# Altium project CRD25DA12N-FMC V1-1 (07-2023).PrjPcb (part 2 of 8)

## Sheet 03 - Controller.SchDoc: Controller - 25kW WolfPACK FM3 Six-Pack Inverter
size 431 x 279 mm; Date: 07/2023; DocumentNumber: CRD25DA12N-FMC; Revision: 1.1; SheetNumber: 3; SheetTotal: 8; SheetSize: B
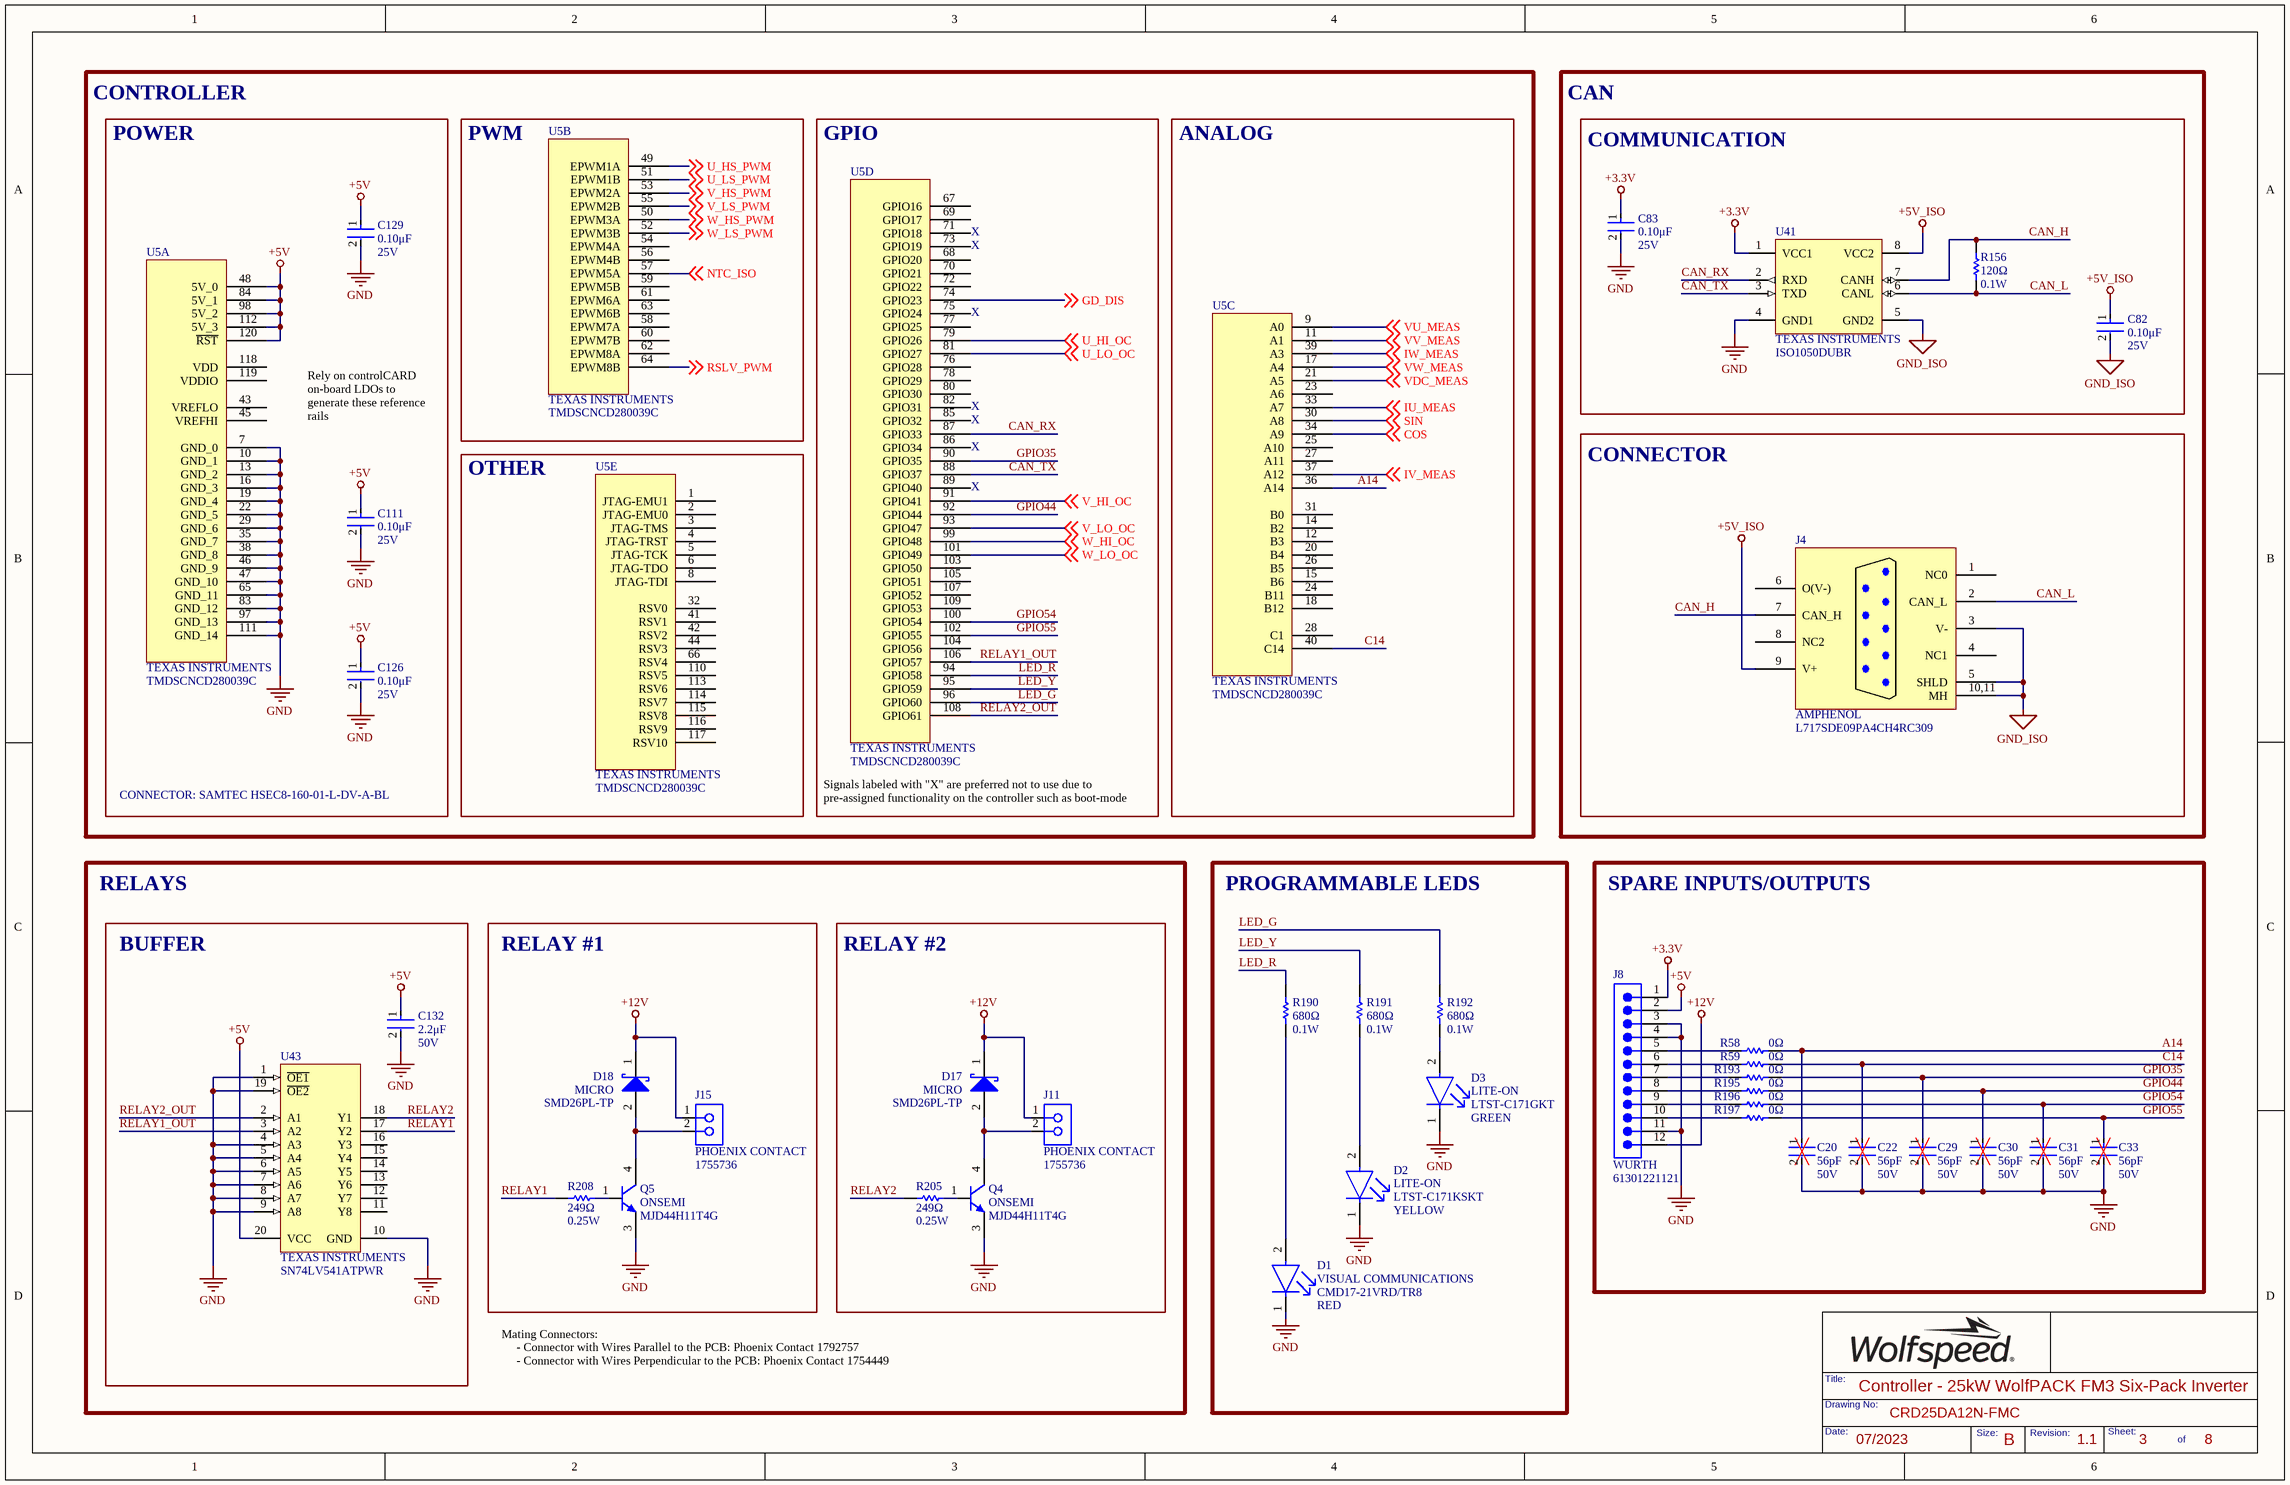
[diagram p2: 03 - Controller.SchDoc]

### Parts
C20  Capacitance: 56pF  Voltage Rating: 50V  [FP-C0603C-CF-IPC_B]  (hidden comment: CL10C560JB8NNNC)
C22  Capacitance: 56pF  Voltage Rating: 50V  [FP-C0603C-CF-IPC_B]  (hidden comment: CL10C560JB8NNNC)
C29  Capacitance: 56pF  Voltage Rating: 50V  [FP-C0603C-CF-IPC_B]  (hidden comment: CL10C560JB8NNNC)
C30  Capacitance: 56pF  Voltage Rating: 50V  [FP-C0603C-CF-IPC_B]  (hidden comment: CL10C560JB8NNNC)
C31  Capacitance: 56pF  Voltage Rating: 50V  [FP-C0603C-CF-IPC_B]  (hidden comment: CL10C560JB8NNNC)
C33  Capacitance: 56pF  Voltage Rating: 50V  [FP-C0603C-CF-IPC_B]  (hidden comment: CL10C560JB8NNNC)
C82  Voltage Rating: 25V  Capacitance: 0.10μF  [FP-C0603C-CF-IPC_B]  (hidden comment: C0603C104K3RACTU)
C83  Voltage Rating: 25V  Capacitance: 0.10μF  [FP-C0603C-CF-IPC_B]  (hidden comment: C0603C104K3RACTU)
C111  Voltage Rating: 25V  Capacitance: 0.10μF  [FP-C0603C-CF-IPC_B]  (hidden comment: C0603C104K3RACTU)
C126  Voltage Rating: 25V  Capacitance: 0.10μF  [FP-C0603C-CF-IPC_B]  (hidden comment: C0603C104K3RACTU)
C129  Voltage Rating: 25V  Capacitance: 0.10μF  [FP-C0603C-CF-IPC_B]  (hidden comment: C0603C104K3RACTU)
C132  Voltage Rating: 50V  Capacitance: 2.2μF  [FP-C0603C-CF-IPC_B]  (hidden comment: GRT188R61H225ME13D)
D1  value RED  Manufacturer: VISUAL COMMUNICATIONS  [FP-LTST-C171GKT-MFG-RED]  (hidden comment: CMD17-21VRD/TR8)
D2  LTST-C171KSKT  value YELLOW  Manufacturer: LITE-ON  [FP-LTST-C171GKT-MFG-YELLOW]
D3  value GREEN  Manufacturer: LITE-ON  [FP-LTST-C171GKT-MFG]  (hidden comment: LTST-C171GKT)
D17  SMD26PL-TP  Manufacturer Print: MICRO  [ONSC-SOD-123FL-2-498-01_V]
D18  SMD26PL-TP  Manufacturer Print: MICRO  [ONSC-SOD-123FL-2-498-01_V]
J4  Manufacturer: AMPHENOL  [L717SDE09PA4CH4RC309]  (hidden comment: L717SDE09PA4CH4RC309)
J8  Manufacturer Print: WURTH  [FP-61301221121-MFG]  (hidden comment: 61301221121)
J11  Manufacturer: PHOENIX CONTACT  [1755736]  (hidden comment: 1755736)
J15  Manufacturer: PHOENIX CONTACT  [1755736]  (hidden comment: 1755736)
Q4  Manufacturer: ONSEMI  [ONSC-DPAK-3-369C-01_V]  (hidden comment: MJD44H11T4G)
Q5  Manufacturer: ONSEMI  [ONSC-DPAK-3-369C-01_V]  (hidden comment: MJD44H11T4G)
R58  Resistance: 0Ω  [FP-MCR03-IPC_B]  (hidden comment: CRCW06030000Z0EB)
R59  Resistance: 0Ω  [FP-MCR03-IPC_B]  (hidden comment: CRCW06030000Z0EB)
R156  Resistance: 120Ω  Max Power Dissipation: 0.1W  [FP-MCR03-IPC_B]  (hidden comment: RC0603JR-07120RL)
R190  Power Rating: 0.1W  Resistance: 680Ω  [FP-MCR03-IPC_B]  (hidden comment: RC0603FR-07680RL)
R191  Power Rating: 0.1W  Resistance: 680Ω  [FP-MCR03-IPC_B]  (hidden comment: RC0603FR-07680RL)
R192  Power Rating: 0.1W  Resistance: 680Ω  [FP-MCR03-IPC_B]  (hidden comment: RC0603FR-07680RL)
R193  Resistance: 0Ω  [FP-MCR03-IPC_B]  (hidden comment: CRCW06030000Z0EB)
R195  Resistance: 0Ω  [FP-MCR03-IPC_B]  (hidden comment: CRCW06030000Z0EB)
R196  Resistance: 0Ω  [FP-MCR03-IPC_B]  (hidden comment: CRCW06030000Z0EB)
R197  Resistance: 0Ω  [FP-MCR03-IPC_B]  (hidden comment: CRCW06030000Z0EB)
R205  Resistance: 249Ω  Power Rating: 0.25W  [FP-MCR18-IPC_A]  (hidden comment: RC1206FR-07249RL)
R208  Resistance: 249Ω  Power Rating: 0.25W  [FP-MCR18-IPC_A]  (hidden comment: RC1206FR-07249RL)
U5  TMDSCNCD280039C  Manufacturer: TEXAS INSTRUMENTS  [TMDSCNCD280039C]  (parts A,B,C,D,E of 5)
U41  ISO1050DUBR  Manufacturer Print: TEXAS INSTRUMENTS  [DUB0008A_M]
U43  Manufacturer: TEXAS INSTRUMENTS  [PW0020A_L]  (hidden comment: SN74LV541ATPWR)

### Blocks framed on the sheet
POWER: C111 C126 C129 U5
PWM: U5
GPIO: U5
ANALOG: U5
COMMUNICATION: C82 C83 R156 U41
CONNECTOR: J4
OTHER: U5
PROGRAMMABLE LEDS: D1-D3 R190-R192
SPARE INPUTS/OUTPUTS: C20 C22 C29-C31 C33 J8 R58 R59 R193 R195-R197
BUFFER: C132 U43
RELAY #1: D18 J15 Q5 R208
RELAY #2: D17 J11 Q4 R205

### Nets
+3.3V: C83.1 J8.1 U41.1(VCC1)
+5V: C111.1 C126.1 C129.1 C132.1 J8.2 U5.48(5V_0) U5.84(5V_1) U5.98(5V_2) U5.112(5V_3) U5.120(~{RST}) U43.20(VCC)
+5V_ISO: C82.1 J4.9(V+) U41.8(VCC2)
+12V: D17.1(K) D18.1(K) J8.12 J11.1 J15.1
GND: C20.2 C22.2 C29.2 C30.2 C31.2 C33.2 C83.2 C111.2 C126.2 C129.2 C132.2 D1.1(C) D2.1(C) D3.1(C) J8.3 J8.4 J8.11 Q4.3(E) Q5.3(E) U5.7(GND_0) U5.10(GND_1) U5.13(GND_2) U5.16(GND_3) U5.19(GND_4) U5.22(GND_5) U5.29(GND_6) U5.35(GND_7) U5.38(GND_8) U5.46(GND_9) U5.47(GND_10) U5.65(GND_11) U5.83(GND_12) U5.97(GND_13) U5.111(GND_14) U41.4(GND1) U43.1(~{OE1}) U43.4(A3) U43.5(A4) U43.6(A5) U43.7(A6) U43.8(A7) U43.9(A8) U43.10(GND) U43.19(~{OE2})
GND_ISO: C82.2 J4.3(V-) J4.5(SHLD) J4.10,11(MH) U41.5(GND2)
A14: C20.1 R58.2 U5.36(A14)
C14: C22.1 R59.2 U5.40(C14)
CAN_H: J4.7(CAN_H) R156.2 U41.7(CANH)
CAN_L: J4.2(CAN_L) R156.1 U41.6(CANL)
CAN_RX: U5.87(GPIO33) U41.2(RXD)
CAN_TX: U5.88(GPIO37) U41.3(TXD)
COS: U5.34(A9) ; off-sheet COS
GD_DIS: U5.74(GPIO23) ; off-sheet GD_DIS
GPIO35: C29.1 R193.2 U5.90(GPIO35)
GPIO44: C30.1 R195.2 U5.92(GPIO44)
GPIO54: C31.1 R196.2 U5.100(GPIO54)
GPIO55: C33.1 R197.2 U5.102(GPIO55)
IU_MEAS: U5.33(A7) ; off-sheet IU_MEAS
IV_MEAS: U5.37(A12) ; off-sheet IV_MEAS
IW_MEAS: U5.39(A3) ; off-sheet IW_MEAS
LED_G: R192.2 U5.96(GPIO60)
LED_R: R190.2 U5.94(GPIO58)
LED_Y: R191.2 U5.95(GPIO59)
NTC_ISO: U5.57(EPWM5A) ; off-sheet NTC_ISO
RELAY1: R208.1 U43.17(Y2)
RELAY1_OUT: U5.106(GPIO57) U43.3(A2)
RELAY2: R205.1 U43.18(Y1)
RELAY2_OUT: U5.108(GPIO61) U43.2(A1)
RSLV_PWM: U5.64(EPWM8B) ; off-sheet RSLV_PWM
SIN: U5.30(A8) ; off-sheet SIN
U_HI_OC: U5.79(GPIO26) ; off-sheet U_HI_OC
U_HS_PWM: U5.49(EPWM1A) ; off-sheet U_HS_PWM
U_LO_OC: U5.81(GPIO27) ; off-sheet U_LO_OC
U_LS_PWM: U5.51(EPWM1B) ; off-sheet U_LS_PWM
V_HI_OC: U5.91(GPIO41) ; off-sheet V_HI_OC
V_HS_PWM: U5.53(EPWM2A) ; off-sheet V_HS_PWM
V_LO_OC: U5.93(GPIO47) ; off-sheet V_LO_OC
V_LS_PWM: U5.55(EPWM2B) ; off-sheet V_LS_PWM
VDC_MEAS: U5.21(A5) ; off-sheet VDC_MEAS
VU_MEAS: U5.9(A0) ; off-sheet VU_MEAS
VV_MEAS: U5.11(A1) ; off-sheet VV_MEAS
VW_MEAS: U5.17(A4) ; off-sheet VW_MEAS
W_HI_OC: U5.99(GPIO48) ; off-sheet W_HI_OC
W_HS_PWM: U5.50(EPWM3A) ; off-sheet W_HS_PWM
W_LO_OC: U5.101(GPIO49) ; off-sheet W_LO_OC
W_LS_PWM: U5.52(EPWM3B) ; off-sheet W_LS_PWM
NetD1_2: D1.2(A) R190.1
NetD2_2: D2.2(A) R191.1
NetD3_2: D3.2(A) R192.1
NetD17_2: D17.2(A) J11.2 Q4.4(C)
NetD18_2: D18.2(A) J15.2 Q5.4(C)
NetJ8_5: J8.5 R58.1
NetJ8_6: J8.6 R59.1
NetJ8_7: J8.7 R193.1
NetJ8_8: J8.8 R195.1
NetJ8_9: J8.9 R196.1
NetJ8_10: J8.10 R197.1
NetQ4_1: Q4.1(B) R205.2
NetQ5_1: Q5.1(B) R208.2

Not connected (* = marked no-connect by the designer): J4 1(NC0) 4(NC1) 6(O(V-)) 8(NC2); U5 1(JTAG-EMU1) 2(JTAG-EMU0) 3(JTAG-TMS) 4(JTAG-TRST) 5(JTAG-TCK) 6(JTAG-TDO) 8(JTAG-TDI) 12(B3) 14(B2) 15(B6) 18(B12) 20(B4) 23(A6) 24(B11) 25(A10) 26(B5) 27(A11) 28(C1) 31(B0) 32(RSV0) 41(RSV1) 42(RSV2) 43(VREFLO) 44(RSV3) 45(VREFHI) 54(EPWM4A) 56(EPWM4B) 58(EPWM7A) 59(EPWM5B) 60(EPWM7B) 61(EPWM6A) 62(EPWM8A) 63(EPWM6B) 66(RSV4) 67(GPIO16) 68(GPIO20) 69(GPIO17) 70(GPIO21) 71(GPIO18) 72(GPIO22) 73(GPIO19) 75(GPIO24) 76(GPIO28) 77(GPIO25) 78(GPIO29) 80(GPIO30) 82(GPIO31) 85(GPIO32) 86(GPIO34) 89(GPIO40) 103(GPIO50) 104(GPIO56) 105(GPIO51) 107(GPIO52) 109(GPIO53) 110(RSV5) 113(RSV6) 114(RSV7) 115(RSV8) 116(RSV9) 117(RSV10) 118(VDD) 119(VDDIO); U43 11(Y8) 12(Y7) 13(Y6) 14(Y5) 15(Y4) 16(Y3)

### Notes on the sheet
- CONTROLLER
- CAN
- (near U5) X
- Rely on controlCARD on-board LDOs to generate these reference rails
- CONNECTOR: SAMTEC HSEC8-160-01-L-DV-A-BL
- Signals labeled with "X" are preferred not to use due to pre-assigned functionality on the controller such as boot-mode selection or on-board LEDs
- RELAYS
- Mating Connectors:
  - Connector with Wires Parallel to the PCB: Phoenix Contact 1792757
  - Connector with Wires Perpendicular to the PCB: Phoenix Contact 1754449
- Title:
- Date:
- Drawing No:
- Size:
- Revision:
- Sheet:
- of

### Library data of the parts
C20 C22 C29-C31 C33 = CL10C560JB8NNNC: CAP CER 56PF 50V C0G/NP0 0603; Manufacturer: SAMSUNG; Material: Ceramic; Tolerance: 5%; Dielectric: C0G; Temperature Coefficient: 30ppm/°C; Supplier 1: Arrow Electronics; Manufacturer Part Number: CL10C560JB8NNNC; RoHS: Yes; Category: Ceramic Capacitors; Stock 1: 60182; Pricing 1: 1=0.05960, 10=0.01370, 25=0.01360, 100=0.01080, 250=0.01070, 500=0.00740, 1000=0.00590, 3000=0.00560, 6000=0.00530, 15000=0.00500, 30000=0.00470 (USD); Mount: Surface Mount; Case Code (Metric): 1608; Case Code (Imperial): 0603; Min Operating Temperature: -55°C; Max Operating Temperature: 125°C; Packaging: Tape and Reel; Package Quantity: 1; Voltage: 50V; Voltage Rating (DC): 50V; Series: CL; Construction: Flat; Termination: SMD/SMT; Length: 1.6mm; Width: 0.031inch; Height: 0.8mm; Thickness: 0.035inch; Depth: 0.8mm; Radiation Hardening: No; Lead Free: Lead Free; RoHS Compliant: Yes; ComponentLink1URL: https://datasheet.ciiva.com/25803/cl10c560jb8nnnc-25803592.pdf?src-supplier=Digi-Key; ComponentLink1Description: https://datasheet.ciiva.com/25803/cl10c560jb8nnnc-25803592.pdf?src-supplier=Digi-Key; ComponentLink2URL: https://datasheet.ciiva.com/26838/getdatasheetpartid-640760-26838546.pdf?src-supplier=Verical; ComponentLink2Description: https://datasheet.ciiva.com/26838/getdatasheetpartid-640760-26838546.pdf?src-supplier=Verical; ComponentLink3URL: https://datasheet.ciiva.com/29198/456837-da-01-en-vs-kondensator-0603-29198873.pdf?src-supplier=Conrad; ComponentLink3Description: https://datasheet.ciiva.com/29198/456837-da-01-en-vs-kondensator-0603-29198873.pdf?src-supplier=Conrad; ComponentLink4URL: https://datasheet.ciiva.com/48428/mlcc-catalogdownload2013-eng-48428598.pdf?src-supplier=Distrelec; ComponentLink4Description: https://datasheet.ciiva.com/48428/mlcc-catalogdownload2013-eng-48428598.pdf?src-supplier=Distrelec; ComponentLink5URL: https://datasheet.ciiva.com/16449/cl05b104kq5nnnc-16449527.pdf?src-supplier=Future+Electronics; ComponentLink5Description: https://datasheet.ciiva.com/16449/cl05b104kq5nnnc-16449527.pdf?src-supplier=Future+Electronics; Supplier Part Number 1: CL10C560JB8NNNC; Package: 0603; Value: 56pF
C82 C83 C111 C126 C129 = CMP-2006-03057-2: CAP CER 0.1UF 25V X7R 0603; Manufacturer: KEMET; Value: 0.10μF; Material: Ceramic; Tolerance: 0.1; Temperature Coefficient: 30ppm/°C; Automotive Grade: Grade 1; Lead Free: Yes; Device Class L3: Ceramic Capacitors; Manufacturer Part Number: C0603C104K3RACTU; Digikey Description: CAP CER 0.1UF 25V X7R 0603; Mouser Description: Multilayer Ceramic Capacitors MLCC - SMD/SMT 25volts 0.1uF X7R 10%; Package: 0603; Temperature Range Low: -55°C; Automotive: Yes; Device Class L2: Capacitors; Octopart: https://octopart.com/c0603c104k3ractu-kemet-127541; ComponentLink2Description: Datasheet; ComponentLink2URL: https://api.kemet.com/component-edge/download/datasheet/C0603C100J5GACAUTO.pdf; Temperature Range High: +125°C; RoHS: TRUE; Device Class L1: Passive Components; Category: Cap; Temperature: -55°C to +125°C; Height: 0.87mm; Temperature Characteristic: X7R
C132 = GRT188R61H225ME13D: CAP CER 2.2UF 50V X5R 0603; Manufacturer: MURATA; Tolerance: 20%; Value: 2.2μF; Supplier 1: Arrow Electronics; Manufacturer Part Number: GRT188R61H225ME13D; RoHS: Yes; Category: Ceramic Capacitors; Stock 1: 3937; Pricing 1: 1=0.29580, 10=0.20370, 25=0.18090, 100=0.12380, 250=0.12190, 500=0.10920, 1000=0.07700, 3000=0.07630 (USD); Mount: Surface Mount; Case Code (Metric): 1608; Case Code (Imperial): 0603; Min Operating Temperature: -55°C; Max Operating Temperature: 85°C; Packaging: Tape and Reel; Length: 0.063inch; Width: 0.031inch; Thickness: 0.035inch; Ratings: AEC-Q200; RoHS Compliant: Yes; ComponentLink1URL: http://search.murata.co.jp/Ceramy/image/img/A01X/G101/ENG/GRT188R61H225ME13-01.pdf?src-supplier=Digi-Key; ComponentLink1Description: http://search.murata.co.jp/Ceramy/image/img/A01X/G101/ENG/GRT188R61H225ME13-01.pdf?src-supplier=Digi-Key; ComponentLink2URL: https://search.murata.co.jp/Ceramy/image/img/A01X/G101/ENG/GRT188R61H225ME13-01.pdf?src-supplier=Digi-Key; ComponentLink2Description: https://search.murata.co.jp/Ceramy/image/img/A01X/G101/ENG/GRT188R61H225ME13-01.pdf?src-supplier=Digi-Key; Supplier Part Number 1: GRT188R61H225ME13D; Package: 0603
D1 = CMD17-21VRD/TR8: LED RED DIFFUSED 0805 SMD; Power Rating: 100mW; Luminous Intensity: 6mcd; Viewing Angle: 140°; Lens Style: Diffused,Tinted,Rectangular,Colored; Forward Current: 20mA; Forward Voltage: 2V; Wavelength: 640nm; Reverse Voltage (DC): 5V; Number of LEDs: 1; Supplier 1: Newark; RoHS: Yes; Category: LEDs; Stock 1: 1791; Pricing 1: 1=0.55000, 25=0.37500, 50=0.31600, 100=0.25700, 250=0.25600, 500=0.25400, 1000=0.21500 (USD); Mount: Surface Mount; Package: 0805; Number of Pins: 2; Color: RED; Case Code (Metric): 2012; Case Code (Imperial): 0805; Lens Color: Red; Min Operating Temperature: -40°C; Max Operating Temperature: 85°C; Packaging: Tape and Reel; Package Quantity: 1; Illumination Color: Red; Test Current: 20mA; Reverse Voltage: 5V; Length: 2mm; Width: 1.25mm; Height: 1.1mm; RoHS Compliant: Yes; Lead Free: Lead Free; ComponentLink1URL: http://www.mouser.com/ds/2/423/CMD1721ver1-1064576.pdf?src-supplier=Mouser; ComponentLink1Description: http://www.mouser.com/ds/2/423/CMD1721ver1-1064576.pdf?src-supplier=Mouser; ComponentLink2URL: https://www.alliedelec.com/m/d/ea8f758becbd32522d2612194452bcae.pdf?src-supplier=Allied+Electronics; ComponentLink2Description: https://www.alliedelec.com/m/d/ea8f758becbd32522d2612194452bcae.pdf?src-supplier=Allied+Electronics; ComponentLink3URL: http://www.onlinecomponents.com/productFiles/mf-CM/2cmd17-21seriessmtleds0805packagesize.pdf?src-supplier=Onlinecomponents.com; ComponentLink3Description: http://www.onlinecomponents.com/productFiles/mf-CM/2cmd17-21seriessmtleds0805packagesize.pdf?src-supplier=Onlinecomponents.com; ComponentLink4URL: https://vcclite.com/wp-content/uploads/wpallimport/files/files/CMD1721Seriesver3.pdf?src-supplier=Digi-Key; ComponentLink4Description: https://vcclite.com/wp-content/uploads/wpallimport/files/files/CMD1721Seriesver3.pdf?src-supplier=Digi-Key; Supplier Part Number 1: 45X6246; Manufacturer Part Number: CMD17-21VRD/TR8
D2 = LTST-C171KSKT: LED YELLOW CLEAR 0805 SMD; Lens Color: Colorless; Number of LEDs: 1; Reverse Voltage: 5V; Viewing Angle: 130°; Lens Style: Diffused,Colorless,Rectangular,Clear; Luminous Intensity: 50mcd; Forward Voltage: 2V; Dominant Wavelength: 587nm; Test Current: 20mA; Wavelength: 588nm; Forward Current: 30mA; Max Power Dissipation: 75mW; Supplier 1: Rs; Manufacturer Part Number: LTST-C171KSKT; RoHS: Yes; Category: LEDs; Stock 1: 850; Mount: Surface Mount; Package: 0805; Number of Pins: 2; Color: Yellow; Case Code (Metric): 2012; Case Code (Imperial): 0805; Min Operating Temperature: -55°C; Max Operating Temperature: 85°C; Package Quantity: 1; Packaging: Tape and Reel; Lens Transparency: Clear; Series: CHIPLED 0805; Illumination Color: Yellow; Power Rating: 75mW; Number of Elements: 1; Power Dissipation: 75mW; Length: 2mm; Width: 1.25mm; Height: 0.8mm; Depth: 1.25mm; Radiation Hardening: No; Lead Free: Lead Free; RoHS Compliant: Yes; ComponentLink1URL: https://datasheet.ciiva.com/19466/2075639-19466196.pdf?src-supplier=Jameco; ComponentLink1Description: https://datasheet.ciiva.com/19466/2075639-19466196.pdf?src-supplier=Jameco; ComponentLink2URL: https://datasheet.ciiva.com/12403/lite-on-ltst-c171kskt-190118-12403721.pdf?src-supplier=Mouser; ComponentLink2Description: https://datasheet.ciiva.com/12403/lite-on-ltst-c171kskt-190118-12403721.pdf?src-supplier=Mouser; ComponentLink3URL: https://datasheet.ciiva.com/16200/lite-on20ltst-c171kskt-16200102.pdf?src-supplier=Future+Electronics; ComponentLink3Description: https://datasheet.ciiva.com/16200/lite-on20ltst-c171kskt-16200102.pdf?src-supplier=Future+Electronics; ComponentLink4URL: https://datasheet.ciiva.com/15118/getdatasheetpartid-233685-15118145.pdf?src-supplier=Verical; ComponentLink4Description: https://datasheet.ciiva.com/15118/getdatasheetpartid-233685-15118145.pdf?src-supplier=Verical; ComponentLink5URL: https://datasheet.ciiva.com/11774/0900766b80dc029a-11774587.pdf?src-supplier=Rs; ComponentLink5Description: https://datasheet.ciiva.com/11774/0900766b80dc029a-11774587.pdf?src-supplier=Rs; ComponentLink6URL: https://datasheet.ciiva.com/2110/s-110-ltst-c171kskt-2110148.pdf?src-supplier=Digi-Key; ComponentLink6Description: https://datasheet.ciiva.com/2110/s-110-ltst-c171kskt-2110148.pdf?src-supplier=Digi-Key; ComponentLink7URL: https://datasheet.ciiva.com/2110/s-110-ltst-c171kskt-2110147.pdf?src-supplier=Digi-Key; ComponentLink7Description: https://datasheet.ciiva.com/2110/s-110-ltst-c171kskt-2110147.pdf?src-supplier=Digi-Key; ComponentLink8URL: https://datasheet.ciiva.com/2110/s-110-ltst-c171kskt-2110149.pdf?src-supplier=Digi-Key; ComponentLink8Description: https://datasheet.ciiva.com/2110/s-110-ltst-c171kskt-2110149.pdf?src-supplier=Digi-Key; Supplier Part Number 1: 6920950
D3 = CMP-22017-000007-1: LED GREEN CLEAR CHIP SMD; Luminous Intensity: 12mcd; Lens Color: Colorless; Dominant Wavelength: 569nm; Number of LEDs: 1; Power Dissipation: 100mW; Viewing Angle: 130°; Reverse Voltage: 5V; Test Current: 10mA; Forward Voltage: 2.1V; Wavelength: 585nm; Lens Style: Diffused; Forward Current: 30mA; Height: 0.8mm; Mount: Surface Mount; Package Quantity: 1; Length: 2mm; Case Code (Metric): 2012; Number of Pins: 2; Number of Elements: 1; Packaging: Tape and Reel; Color: GREEN; Min Operating Temperature: -55°C; Case/Package: 0805; Power Rating: 100mW; Max Operating Temperature: 85°C; Radiation Hardening: No; Depth: 1.25mm; Lens Transparency: Clear; Width: 1.25mm; Lead Free: Lead Free; Case Code (Imperial): 0805; Illumination Color: Green; Manufacturer Part Number: LTST-C171GKT; Package: 0805
D17 D18 = SMD26PL-TP: DIODE SCHOTTKY 60V 2A SOD123FL; Manufacturer: MICRO COMMERCIAL; Forward Voltage: 700mV; Max Reverse Current: 500uA; Max Surge Current: 50A; Max Power Dissipation: 1.68W; Supplier 1: Digi-Key; Manufacturer Part Number: SMD26PL-TP; RoHS: Yes; Category: Rectifier Diodes; Stock 1: 317348; Pricing 1: 1=0.40000, 10=0.30200, 100=0.18790, 500=0.12854, 1000=0.09888 (USD); Mount: Surface Mount; Number of Pins: 2; Min Operating Temperature: -65°C; Max Operating Temperature: 125°C; Packaging: Tape and Reel; Package Quantity: 1; Average Rectified Current: 2A; Max Repetitive Reverse Voltage (Vrrm): 60V; Max Reverse Voltage (DC): 60V; Lead Free: Lead Free; RoHS Compliant: Yes; ComponentLink1URL: https://datasheet.ciiva.com/4717/smd22pl-smd210plsod-123fl-27814-4717414.pdf?src-supplier=Mouser; ComponentLink1Description: https://datasheet.ciiva.com/4717/smd22pl-smd210plsod-123fl-27814-4717414.pdf?src-supplier=Mouser; ComponentLink2URL: https://datasheet.ciiva.com/17444/smd22pl-smd210plsod-123fl-17444944.pdf?src-supplier=Future+Electronics; ComponentLink2Description: https://datasheet.ciiva.com/17444/smd22pl-smd210plsod-123fl-17444944.pdf?src-supplier=Future+Electronics; ComponentLink3URL: https://datasheet.ciiva.com/917/smd22pl-smd210plsod-123fl-917242.pdf?src-supplier=Digi-Key; ComponentLink3Description: https://datasheet.ciiva.com/917/smd22pl-smd210plsod-123fl-917242.pdf?src-supplier=Digi-Key; ComponentLink4URL: https://datasheet.ciiva.com/917/smd22pl-smd210plsod-123fl-917243.pdf?src-supplier=Digi-Key; ComponentLink4Description: https://datasheet.ciiva.com/917/smd22pl-smd210plsod-123fl-917243.pdf?src-supplier=Digi-Key; ComponentLink5URL: https://datasheet.ciiva.com/917/smd22pl-smd210plsod-123fl-917244.pdf?src-supplier=Digi-Key; ComponentLink5Description: https://datasheet.ciiva.com/917/smd22pl-smd210plsod-123fl-917244.pdf?src-supplier=Digi-Key; Supplier Part Number 1: SMD26PL-TPMSCT-ND; Value: N/A; Package: SOD-123F
J4 = L717SDE09PA4CH4RC309: CONN D-SUB PLUG 9POS R/A SLDR; Number of Terminals/Pins: 9; Connector Type: D-Sub,Plug; Voltage Rating: 250V; Current Rating: 5A; Number of Ports: 1; Pitch: 2.74mm; Value: N/A; Package: N/A; Supplier 1: Allied Electronics; RoHS: Yes; Category: Uncategorized; Mount: Through Hole; Contact Plating: Gold; Contact Material: Brass; Color: Black; Housing Material: Thermoplastic; Min Operating Temperature: -55°C; Max Operating Temperature: 155°C; Number of Rows: 2; Packaging: Tray; Number of Positions: 9; Termination: Solder; Max Supply Voltage (AC): 250V; Number of Contacts: 9; Orientation: Right Angle; Series: SD; Contact Type: Signal; Length: 30.81mm; Depth: 20.3mm; Lead Free: Lead Free; RoHS Compliant: Yes; ComponentLink1URL: https://datasheet.ciiva.com/16443/l717sde09pa4ch4rc309-16443356.pdf?src-supplier=Future+Electronics; ComponentLink1Description: https://datasheet.ciiva.com/16443/l717sde09pa4ch4rc309-16443356.pdf?src-supplier=Future+Electronics; ComponentLink2URL: https://datasheet.ciiva.com/12662/l717sde09pa4ch4rc309-12662371.pdf?src-supplier=Mouser; ComponentLink2Description: https://datasheet.ciiva.com/12662/l717sde09pa4ch4rc309-12662371.pdf?src-supplier=Mouser; ComponentLink3URL: https://datasheet.ciiva.com/16914/70145027-16914009.pdf?src-supplier=Allied+Electronics; ComponentLink3Description: https://datasheet.ciiva.com/16914/70145027-16914009.pdf?src-supplier=Allied+Electronics; ComponentLink4URL: https://datasheet.ciiva.com/16748/sd-hdh808-16748518.pdf?; ComponentLink4Description: https://datasheet.ciiva.com/16748/sd-hdh808-16748518.pdf?; Supplier Part Number 1: 70145033; Manufacturer Part Number: L717SDE09PA4CH4RC309
J8 = 61301221121: CONN HEADER VERT 12POS 2.54MM; Manufacturer: WURTH ELEKTRONIK; Number of Positions: 12; Gender: Male; Voltage Rating: 250V; Pitch: 0.1inch; Supplier 1: Digi-Key; RoHS: Yes; Category: Headers and Wire Housings; Stock 1: 5429; Pricing 1: 1=0.83000, 10=0.70700, 25=0.58920, 50=0.49100, 100=0.44700, 1000=0.40600 (USD); Mount: Through Hole; Contact Plating: Gold; Contact Material: Copper Alloy,Copper; Color: Black; Contact Shape: Square; Contact Finish - Mating: GOLD; Insulation Material: Nylon; Insulation Color: Black; Min Operating Temperature: -40°C; Max Operating Temperature: 105°C; Number of Rows: 2; Packaging: Bulk; Termination: Solder; Number of Contacts: 12; Connector Type: Header; Fastening Type: Pull; Series: WR-PHD; Contact Type: Male Pin; Row Spacing: 0.1inch; Contact Mating Length: 0.236inch; RoHS Compliant: Yes; Flammability Rating: UL94 V-0; ComponentLink1URL: http://www.farnell.com/datasheets/1442180.pdf?src-supplier=Farnell; ComponentLink1Description: http://www.farnell.com/datasheets/1442180.pdf?src-supplier=Farnell; ComponentLink2URL: http://www.farnell.com/datasheets/1442180.pdf?src-supplier=Newark; ComponentLink2Description: http://www.farnell.com/datasheets/1442180.pdf?src-supplier=Newark; ComponentLink3URL: http://www.farnell.com/datasheets/1442180.pdf?src-supplier=Element14; ComponentLink3Description: http://www.farnell.com/datasheets/1442180.pdf?src-supplier=Element14; ComponentLink4URL: https://katalog.we-online.de/em/datasheet/6130xx21121.pdf?src-supplier=Digi-Key; ComponentLink4Description: https://katalog.we-online.de/em/datasheet/6130xx21121.pdf?src-supplier=Digi-Key; Supplier Part Number 1: 732-5297-ND; Package: N/A; Value: N/A; Manufacturer Part Number: 61301221121
J11 J15 = 1755736: TERM BLOCK HDR 2POS VERT 5.08MM; Content: 250pc(s); Industrial packaging: Yes; Number of contacts: 2; Manufacturer URL: http://www.phoenixcontact.com/; Datasheet Version: Apr-16; Pitch: 5.08mm; Datasheet URL: http://www.mouser.com/ds/2/324/ItemDetail_1755736-921028.pdf; Manufacturer Part Number: 1755736; Type: MSTBVA2,5/2-G-5,08; Colour: Green; Supplier 1: Rs; Supplier Part Number 1: 1896199; Value: N/A; Package: N/A
Q4 Q5 = CMP-1046-00010-1: TRANS NPN 80V 8A DPAK; IC Continuous (A): 8; Packing: Tape and Reel; PackageVersion: Rev. E, 02/2014; Polarity: NPN; ComponentLink2Description: Datasheet; ComponentLink2URL: http://www.onsemi.cn/pub_link/Collateral/MJD44H11-D.PDF; ComponentLink1URL: http://www.onsemi.com/; PackageReference: DPAK-3-369C-01; Mounting Technology: Surface Mount; ComponentLink1Description: Manufacturer URL; ComponentLink3URL: http://www.onsemi.cn/pub_link/Collateral/369C.PDF; ComponentLink3Description: Package Specification; PartNumber: MJD44H11T4G; PackageDescription: 3-Pin Flange Mount, Body 6.54 x 6.095 mm, Pitch 2.29 mm; DatasheetVersion: Rev. 16; RoHS: TRUE; Value: N/A; Manufacturer Part Number: MJD44H11T4G; Package: TO-252-3
R58 R59 R193 R195-R197 = CRCW06030000Z0EB: RES SMD 0 OHM JUMPER 1/10W 0603; Manufacturer: VISHAY DALE; Manufacturer Part Number: CRCW06030000Z0EBC; Max Power Dissipation: 100mW; Voltage Rating: 75V; Tolerance: 1%; Temperature Coefficient: 100ppm/°C; Value: 0Ω; Supplier 1: Newark; RoHS: Yes; Category: Chip SMD Resistors; Stock 1: 110000; Pricing 1: 1=0.00300, 10000=0.00300 (USD); Package: 0603; Number of Pins: 2; Case Code (Imperial): 0603; Case Code (Metric): 1608; Weight: 7.1E-05oz; Contact Plating: Tin; Size Code: 0603; Min Operating Temperature: -55°C; Max Operating Temperature: 155°C; Packaging: Tape and Reel; Resistor Type: Thick Film; Number of Terminations: 2; Features: Automotive AEC-Q200; Package Quantity: 10000; Termination: SMD/SMT; Voltage Rating (DC): 75V; Series: CRCW; Construction: Rectangular; Technology: THICK FILM; Length: 1.55mm; Width: 0.033inch; Height: 0.45mm; Depth: 0.85mm; Ratings: AEC-Q200; Radiation Hardening: No; RoHS Compliant: Yes; Lead Free: Lead Free; Military Standard: Not; ComponentLink1URL: https://datasheet.ciiva.com/11808/0900766b80d98afc-11808678.pdf?src-supplier=Rs; ComponentLink1Description: https://datasheet.ciiva.com/11808/0900766b80d98afc-11808678.pdf?src-supplier=Rs; ComponentLink2URL: https://datasheet.ciiva.com/2563/dcrcwe3-2563949.pdf?src-supplier=Digi-Key; ComponentLink2Description: https://datasheet.ciiva.com/2563/dcrcwe3-2563949.pdf?src-supplier=Digi-Key; ComponentLink3URL: https://datasheet.ciiva.com/5550/dcrcwe3-109170-5550748.pdf?src-supplier=Mouser; ComponentLink3Description: https://datasheet.ciiva.com/5550/dcrcwe3-109170-5550748.pdf?src-supplier=Mouser; ComponentLink4URL: https://datasheet.ciiva.com/16430/dcrcwe3-16430060.pdf?src-supplier=Future+Electronics; ComponentLink4Description: https://datasheet.ciiva.com/16430/dcrcwe3-16430060.pdf?src-supplier=Future+Electronics; ComponentLink5URL: https://datasheet.ciiva.com/7791/dcrcwe3-7791992.pdf?src-supplier=Element14; ComponentLink5Description: https://datasheet.ciiva.com/7791/dcrcwe3-7791992.pdf?src-supplier=Element14; Supplier Part Number 1: 48P7902
R156 = RC0603JR-07120RL: RES SMD 120 OHM 5% 1/10W 0603; Manufacturer: YAGEO; Voltage Rating (DC): 50V; Temperature Coefficient: 100ppm/°C; Power Rating: 100mW; Value: 120Ω; Tolerance: 5%; Lead Free: Lead Free; Package: 0603; Max Operating Temperature: 155°C; Length: 1.6mm; Construction: Rectangular; Case Code (Imperial): 0603; Number of Pins: 2; Termination: SMD/SMT; Width: 0.8mm; Height: 0.022inch; Military Standard: Not; Series: RC; Number of Terminations: 2; Package Quantity: 1; Resistance Tolerance: 5%; Voltage Rating: 50V; Case Code (Metric): 1608; Features: Moisture Resistant; REACH SVHC: No SVHC; Min Operating Temperature: -55°C; Size Code: 0603; Packaging: Tape and Reel; Depth: 0.8mm; Resistor Type: Thick Film; RoHS Compliant: Yes; Supplier 1: Rs; Supplier Part Number 1: 2424206; Manufacturer Part Number: RC0603JR-07120RL
R190-R192 = RC0603FR-07680RL: RES 680 OHM 1% 1/10W 0603; Manufacturer: YAGEO; Voltage Rating (DC): 50V; Temperature Coefficient: 100ppm/°C; Max Power Dissipation: 100mW; Value: 680Ω; Supplier 1: Future Electronics; Manufacturer Part Number: RC0603FR-07680RL; RoHS: Yes; Category: Chip SMD Resistors; Stock 1: 1640000; Pricing 1: 5000=0.00150, 50000=0.00140, 200000=0.00140, 625000=0.00130, 2000000=0.00120 (USD); Package: 0603; Number of Pins: 2; Case Code (Imperial): 0603; Case Code (Metric): 1608; Size Code: 0603; Min Operating Temperature: -55°C; Max Operating Temperature: 155°C; Packaging: Tape and Reel; Tolerance: 1%; Resistor Type: Thick Film; Voltage Rating: 50V; Package Quantity: 1; Termination: SMD/SMT; Number of Terminations: 2; Features: Moisture Resistant; Series: RC; Resistance Tolerance: 1%; Construction: Rectangular; Length: 1.6mm; Width: 0.8mm; Height: 0.022inch; Depth: 0.8mm; Reach SVHC Compliant: Yes; Lead Free: Lead Free; Military Standard: Not; RoHS Compliant: Yes; ComponentLink1URL: https://datasheet.ciiva.com/46412/443971-46412854.pdf?src-supplier=Element14; ComponentLink1Description: https://datasheet.ciiva.com/46412/443971-46412854.pdf?src-supplier=Element14; ComponentLink2URL: https://datasheet.ciiva.com/2553/pyu-r-int-thick-7-2553546.pdf?src-supplier=Digi-Key; ComponentLink2Description: https://datasheet.ciiva.com/2553/pyu-r-int-thick-7-2553546.pdf?src-supplier=Digi-Key; ComponentLink3URL: https://datasheet.ciiva.com/2553/pyu-r-int-thick-7-2553547.pdf?src-supplier=Digi-Key; ComponentLink3Description: https://datasheet.ciiva.com/2553/pyu-r-int-thick-7-2553547.pdf?src-supplier=Digi-Key; ComponentLink4URL: https://datasheet.ciiva.com/2553/pyu-r-int-thick-7-2553545.pdf?src-supplier=Digi-Key; ComponentLink4Description: https://datasheet.ciiva.com/2553/pyu-r-int-thick-7-2553545.pdf?src-supplier=Digi-Key; ComponentLink5URL: https://datasheet.ciiva.com/7746/443971-7746389.pdf?src-supplier=Element14; ComponentLink5Description: https://datasheet.ciiva.com/7746/443971-7746389.pdf?src-supplier=Element14; Supplier Part Number 1: 6789788
R205 R208 = RC1206FR-07249RL: RES 249 OHM 1% 1/4W 1206; Manufacturer: YAGEO; Voltage Rating: 200V; Temperature Coefficient: 100ppm/°C; Max Power Dissipation: 250mW; Value: 249Ω; Supplier 1: Future Electronics; Manufacturer Part Number: RC1206FR-07249RL; RoHS: Yes; Category: Chip SMD Resistors; Stock 1: 560000; Pricing 1: 5000=0.00430, 25000=0.00410, 100000=0.00390, 250000=0.00370, 625000=0.00350 (USD); Package: 1206; Case Code (Imperial): 1206; Case Code (Metric): 3216; Size Code: 1206; Min Operating Temperature: -55°C; Max Operating Temperature: 155°C; Tolerance: 1%; Packaging: Tape and Reel; Termination: SMD/SMT; Resistor Type: Thick Film; Voltage Rating (DC): 200V; Features: Moisture Resistant; Series: RC; Number of Terminations: 2; Construction: Rectangular; Length: 3.1mm; Depth: 1.6mm; Military Standard: Not; Lead Free: Lead Free; RoHS Compliant: Yes; ComponentLink1URL: https://datasheet.ciiva.com/16747/pyu-rc1206-51-rohs-l-4-16747103.pdf?src-supplier=Future+Electronics; ComponentLink1Description: https://datasheet.ciiva.com/16747/pyu-rc1206-51-rohs-l-4-16747103.pdf?src-supplier=Future+Electronics; Supplier Part Number 1: 1142064
U5 = TMDSCNCD280039C: EVAL BOARD FOR TMS320F280039C; Supplier 1: Mouser; Manufacturer Part Number: TMDSCNCD280039C; RoHS: No; Category: Embedded Processors and Controllers; Stock 1: 11; Pricing 1: 1=99.75000, 10=99.75000, 50=99.75000, 100=99.75000, 1000=99.75000, 10000=99.75000 (USD); Supplier Part Number 1: 595-TMDSCNCD280039C; Value: N/A; Package: N/A
U41 = ISO1050DUBR: IC TXRX/ISO HALF 1/1 8SOP; Rating: Catalog; Eco-Plan: Green (RoHS & no Sb/Br); Isolated: Yes; Drivers Per Package: 1; SubFamily: CAN; Manufacturer: TEXAS INSTRUMENTS; PackageReference: DUB0008A; PartNumber: ISO1050DUBR; ComponentLink2Description: Package Specification; ComponentLink1Description: Datasheet; Mounting Technology: Surface Mount; ComponentLink1URL: http://www.ti.com/general/docs/lit/getliterature.tsp?genericPartNumber=ISO1050&fileType=pdf; ComponentLink2URL: http://www.ti.com/litv/pdf/mpds247b; PackageDescription: 8-Pin Small Outline Package 2.54 mm Pitch; PackageVersion: revC, May-2006; DatasheetVersion: SLLS983E; Supplier 1: Arrow Electronics; Supplier Part Number 1: ISO1050DUBR; Manufacturer Part Number: ISO1050DUBR; Value: N/A; Package: 8-SOP
U43 = CMP-0440-01163-3: IC BUF NON-INVERT 5.5V 20TSSOP; Bits(#): 8; Voltage(Nom)(V): 5; ICC @ Nom Voltage(Max)(mA): 0.02; VCC(Max)(V): 5.5; Output Type: CMOS; Rating: Catalog; Input Type: TTL; VCC(Min)(V): 4.5; F @ Nom Voltage(Max)(Mhz): 110; tpd @ Nom Voltage(Max)(ns): 7.9; Code_JEDEC: MO-153; PackageReference: PW0020A; DatasheetVersion: SCES573B; Generic Part Number: SN74LV541AT; Operating Temperature Range(C): -40 to 125; PackageVersion: http://www.ti.com/lit/ml/mpds362/mpds362.pdf; Package: 20-TSSOP; Value: N/A; Manufacturer Part Number: SN74LV541ATPWR

## Sheet 04 - Auxiliary Power.SchDoc: Auxiliary Power - 25kW WolfPACK FM3 Six-Pack Inv.
size 431 x 279 mm; Date: 07/2023; DocumentNumber: CRD25DA12N-FMC; Revision: 1.1; SheetNumber: 4; SheetTotal: 8; SheetSize: B
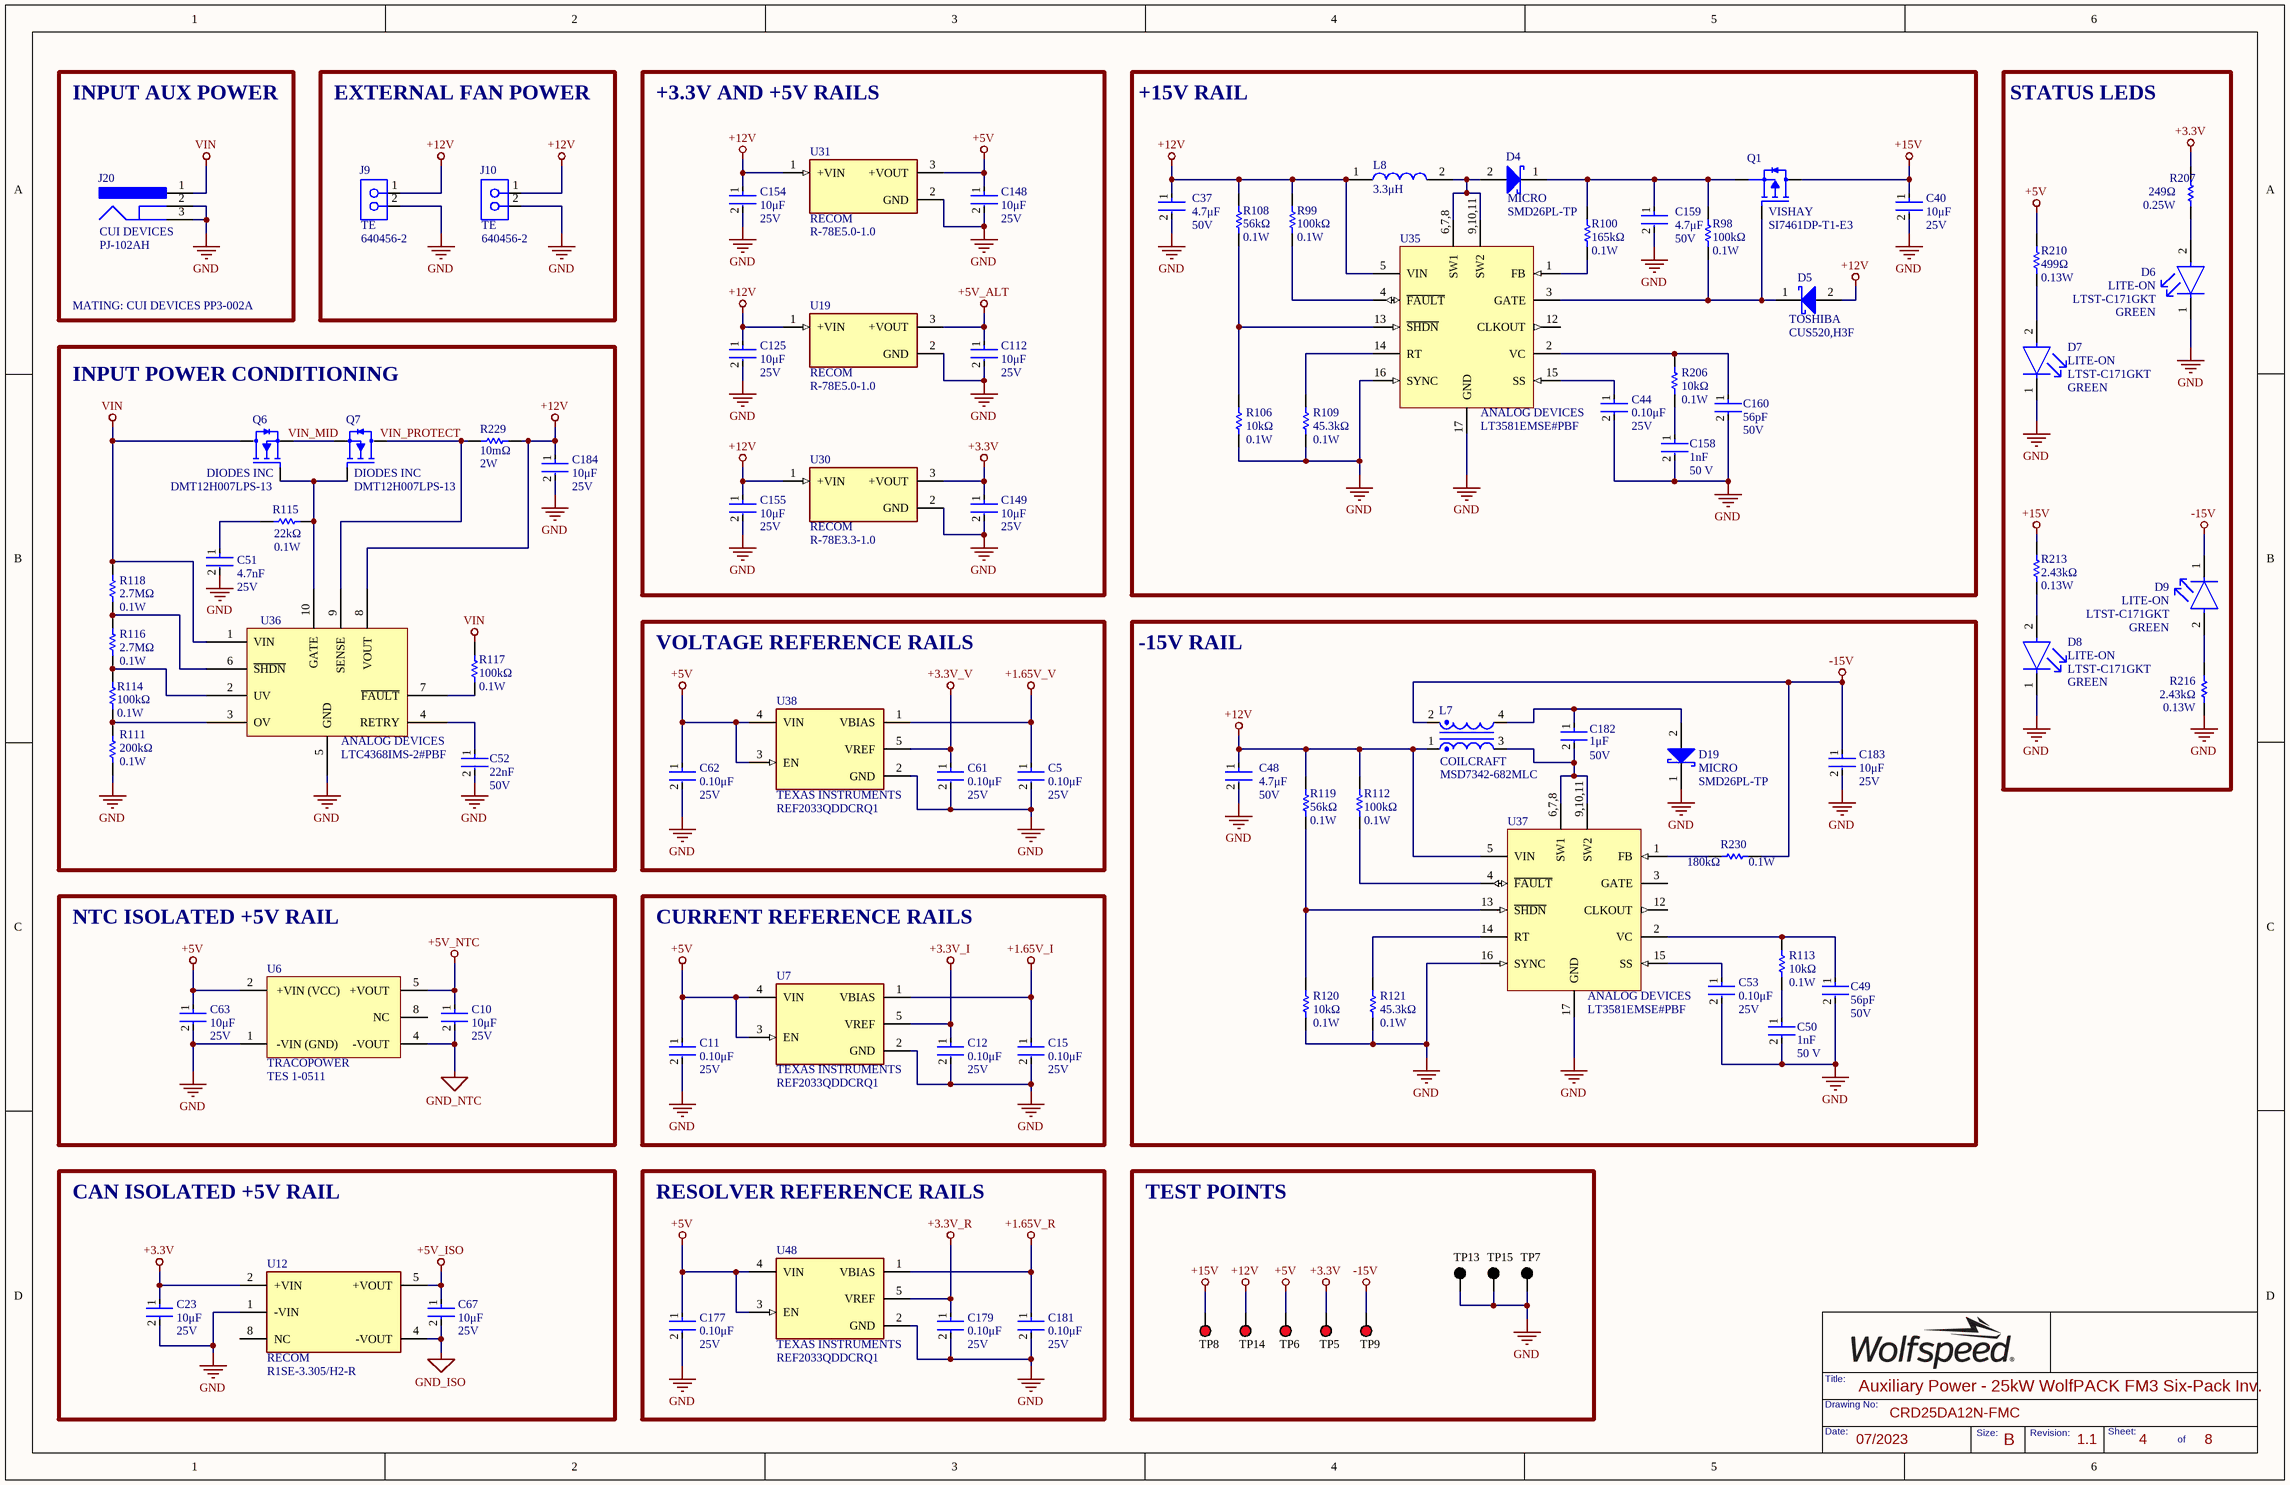
[diagram p3: 04 - Auxiliary Power.SchDoc]

### Parts
C5  Voltage Rating: 25V  Capacitance: 0.10μF  [FP-C0603C-CF-IPC_B]  (hidden comment: C0603C104K3RACTU)
C10  Voltage Rating: 25V  Capacitance: 10μF  [FP-CL31-IPC_B]  (hidden comment: CL31B106KAHSFNE)
C11  Voltage Rating: 25V  Capacitance: 0.10μF  [FP-C0603C-CF-IPC_B]  (hidden comment: C0603C104K3RACTU)
C12  Voltage Rating: 25V  Capacitance: 0.10μF  [FP-C0603C-CF-IPC_B]  (hidden comment: C0603C104K3RACTU)
C15  Voltage Rating: 25V  Capacitance: 0.10μF  [FP-C0603C-CF-IPC_B]  (hidden comment: C0603C104K3RACTU)
C23  Voltage Rating: 25V  Capacitance: 10μF  [FP-CL31-IPC_B]  (hidden comment: CL31B106KAHSFNE)
C37  Voltage Rating: 50V  Capacitance: 4.7μF  [FP-CL31-IPC_C]  (hidden comment: CL31B475KBHNFNE)
C40  Voltage Rating: 25V  Capacitance: 10μF  [FP-CL31-IPC_B]  (hidden comment: CL31B106KAHSFNE)
C44  Voltage Rating: 25V  Capacitance: 0.10μF  [FP-C0603C-CF-IPC_B]  (hidden comment: C0603C104K3RACTU)
C48  Voltage Rating: 50V  Capacitance: 4.7μF  [FP-CL31-IPC_C]  (hidden comment: CL31B475KBHNFNE)
C49  Capacitance: 56pF  Voltage Rating: 50V  [FP-C0603C-CF-IPC_B]  (hidden comment: CL10C560JB8NNNC)
C50  Capacitance: 1nF  Voltage Rating: 50 V  [FP-C0603C-CF-IPC_B]  (hidden comment: C0603C102K5RACAUTO)
C51  Voltage Rating: 25V  Capacitance: 4.7nF  [FP-C0603C-CF-IPC_B]  (hidden comment: C0603C472K3RAC7867)
C52  Capacitance: 22nF  Voltage: 50V  [FP-C0603C-CF-IPC_B]  (hidden comment: CC0805KRX7R9BB223)
C53  Voltage Rating: 25V  Capacitance: 0.10μF  [FP-C0603C-CF-IPC_B]  (hidden comment: C0603C104K3RACTU)
C61  Voltage Rating: 25V  Capacitance: 0.10μF  [FP-C0603C-CF-IPC_B]  (hidden comment: C0603C104K3RACTU)
C62  Voltage Rating: 25V  Capacitance: 0.10μF  [FP-C0603C-CF-IPC_B]  (hidden comment: C0603C104K3RACTU)
C63  Voltage Rating: 25V  Capacitance: 10μF  [FP-CL31-IPC_B]  (hidden comment: CL31B106KAHSFNE)
C67  Voltage Rating: 25V  Capacitance: 10μF  [FP-CL31-IPC_B]  (hidden comment: CL31B106KAHSFNE)
C112  Voltage Rating: 25V  Capacitance: 10μF  [FP-CL31-IPC_B]  (hidden comment: CL31B106KAHSFNE)
C125  Voltage Rating: 25V  Capacitance: 10μF  [FP-CL31-IPC_B]  (hidden comment: CL31B106KAHSFNE)
C148  Voltage Rating: 25V  Capacitance: 10μF  [FP-CL31-IPC_B]  (hidden comment: CL31B106KAHSFNE)
C149  Voltage Rating: 25V  Capacitance: 10μF  [FP-CL31-IPC_B]  (hidden comment: CL31B106KAHSFNE)
C154  Voltage Rating: 25V  Capacitance: 10μF  [FP-CL31-IPC_B]  (hidden comment: CL31B106KAHSFNE)
C155  Voltage Rating: 25V  Capacitance: 10μF  [FP-CL31-IPC_B]  (hidden comment: CL31B106KAHSFNE)
C158  Capacitance: 1nF  Voltage Rating: 50 V  [FP-C0603C-CF-IPC_B]  (hidden comment: C0603C102K5RACAUTO)
C159  Voltage Rating: 50V  Capacitance: 4.7μF  [FP-CL31-IPC_C]  (hidden comment: CL31B475KBHNFNE)
C160  Capacitance: 56pF  Voltage Rating: 50V  [FP-C0603C-CF-IPC_B]  (hidden comment: CL10C560JB8NNNC)
C177  Voltage Rating: 25V  Capacitance: 0.10μF  [FP-C0603C-CF-IPC_B]  (hidden comment: C0603C104K3RACTU)
C179  Voltage Rating: 25V  Capacitance: 0.10μF  [FP-C0603C-CF-IPC_B]  (hidden comment: C0603C104K3RACTU)
C181  Voltage Rating: 25V  Capacitance: 0.10μF  [FP-C0603C-CF-IPC_B]  (hidden comment: C0603C104K3RACTU)
C182  Capacitance: 1μF  Voltage: 50V  [FP-CL21-IPC_A]  (hidden comment: CL21B105KBFNNNE)
C183  Voltage Rating: 25V  Capacitance: 10μF  [FP-CL31-IPC_B]  (hidden comment: CL31B106KAHSFNE)
C184  Voltage Rating: 25V  Capacitance: 10μF  [FP-CL31-IPC_B]  (hidden comment: CL31B106KAHSFNE)
D4  SMD26PL-TP  Manufacturer Print: MICRO  [ONSC-SOD-123FL-2-498-01_V]
D5  CUS520,H3F  Manufacturer Print: TOSHIBA  [FP-USC-MFG]
D6  value GREEN  Manufacturer: LITE-ON  [FP-LTST-C171GKT-MFG]  (hidden comment: LTST-C171GKT)
D7  value GREEN  Manufacturer: LITE-ON  [FP-LTST-C171GKT-MFG]  (hidden comment: LTST-C171GKT)
D8  value GREEN  Manufacturer: LITE-ON  [FP-LTST-C171GKT-MFG]  (hidden comment: LTST-C171GKT)
D9  value GREEN  Manufacturer: LITE-ON  [FP-LTST-C171GKT-MFG]  (hidden comment: LTST-C171GKT)
D19  SMD26PL-TP  Manufacturer Print: MICRO  [ONSC-SOD-123FL-2-498-01_V]
J9  640456-2  Manufacturer Print: TE  [TECO-640456-2_V]
J10  640456-2  Manufacturer Print: TE  [TECO-640456-2_V]
J20  PJ-102AH  Manufacturer Print: CUI DEVICES  [CUI-PJ-102B_V]
L7  MSD7342-682MLC  Manfacturer Print: COILCRAFT  [MSD7342682MLC]
L8  value 3.3μH  [FP-NR5040-H_4_1-MFG]  (hidden comment: NRS5040T3R3NMGJ)
Q1  Manufacturer: VISHAY  [FP-S17-0173-SINGLE-MFG]  (hidden comment: SI7461DP-T1-E3)
Q6  DMT12H007LPS-13  Manufacturer: DIODES INC  [FP-PowerDI5060-8-MFG]
Q7  DMT12H007LPS-13  Manufacturer: DIODES INC  [FP-PowerDI5060-8-MFG]
R98  Resistance: 100kΩ  Power Rating: 0.1W  [FP-MCR03-IPC_B]  (hidden comment: RC0603FR-07100KL)
R99  Resistance: 100kΩ  Power Rating: 0.1W  [FP-MCR03-IPC_B]  (hidden comment: RC0603FR-07100KL)
R100  Resistance: 165kΩ  Power Rating: 0.1W  [FP-MCR03-IPC_B]  (hidden comment: ERJ-3EKF1653V)
R106  Resistance: 10kΩ  Max Power Dissipation: 0.1W  [FP-MCR03-IPC_B]  (hidden comment: ERJ3EKF1002V)
R108  Resistance: 56kΩ  Power Rating: 0.1W  [FP-MCR03-IPC_B]  (hidden comment: RC0603FR-0756KL)
R109  Max Power Dissipation: 0.1W  Resistance: 45.3kΩ  [FP-MCR03-IPC_B]  (hidden comment: RMCF0603FT45K3)
R111  Resistance: 200kΩ  Max Power Dissipation: 0.1W  [FP-MCR03-IPC_B]  (hidden comment: ERJ-3EKF2003V)
R112  Resistance: 100kΩ  Power Rating: 0.1W  [FP-MCR03-IPC_B]  (hidden comment: RC0603FR-07100KL)
R113  Resistance: 10kΩ  Max Power Dissipation: 0.1W  [FP-MCR03-IPC_B]  (hidden comment: ERJ3EKF1002V)
R114  Resistance: 100kΩ  Power Rating: 0.1W  [FP-MCR03-IPC_B]  (hidden comment: RC0603FR-07100KL)
R115  Power Rating: 0.1W  Resistance: 22kΩ  [FP-MCR03-IPC_B]  (hidden comment: ERJ-3EKF2202V)
R116  Power Rating: 0.1W  Resistance: 2.7MΩ  [FP-MCR03-IPC_B]  (hidden comment: RC0603JR-072M7L)
R117  Resistance: 100kΩ  Power Rating: 0.1W  [FP-MCR03-IPC_B]  (hidden comment: RC0603FR-07100KL)
R118  Power Rating: 0.1W  Resistance: 2.7MΩ  [FP-MCR03-IPC_B]  (hidden comment: RC0603JR-072M7L)
R119  Resistance: 56kΩ  Power Rating: 0.1W  [FP-MCR03-IPC_B]  (hidden comment: RC0603FR-0756KL)
R120  Resistance: 10kΩ  Max Power Dissipation: 0.1W  [FP-MCR03-IPC_B]  (hidden comment: ERJ3EKF1002V)
R121  Max Power Dissipation: 0.1W  Resistance: 45.3kΩ  [FP-MCR03-IPC_B]  (hidden comment: RMCF0603FT45K3)
R206  Resistance: 10kΩ  Max Power Dissipation: 0.1W  [FP-MCR03-IPC_B]  (hidden comment: ERJ3EKF1002V)
R207  Resistance: 249Ω  Power Rating: 0.25W  [FP-MCR18-IPC_A]  (hidden comment: RC1206FR-07249RL)
R210  Resistance: 499Ω  Max Power Dissipation: 0.13W  [FP-MCR10-IPC_A]  (hidden comment: RC0805FR-07499RL)
R213  Resistance: 2.43kΩ  Power Rating: 0.13W  [FP-MCR10-IPC_A]  (hidden comment: ERJ-6ENF2431V)
R216  Resistance: 2.43kΩ  Power Rating: 0.13W  [FP-MCR10-IPC_A]  (hidden comment: ERJ-6ENF2431V)
R229  Resistance: 10mΩ  Max Power Dissipation: 2W  [FP-RL2512-IPC_A]  (hidden comment: PE2512FKE7W0R01L)
R230  Resistance: 180kΩ  Max Power Dissipation: 0.1W  [FP-CRGCQ0603-IPC_A]  (hidden comment: CRGCQ0603F180K)
TP5  5010  [KSTN-5010_V]  (value not drawn)
TP6  5010  [KSTN-5010_V]  (value not drawn)
TP7  5011  [KSTN-5011_V]  (value not drawn)
TP8  5010  [KSTN-5010_V]  (value not drawn)
TP9  5010  [KSTN-5010_V]  (value not drawn)
TP13  5011  [KSTN-5011_V]  (value not drawn)
TP14  5010  [KSTN-5010_V]  (value not drawn)
TP15  5011  [KSTN-5011_V]  (value not drawn)
U6  Manufacturer: TRACOPOWER  [TRACO-TES1-5_V]  (hidden comment: TES 1-0511)
U7  Manufacturer: TEXAS INSTRUMENTS  [FP-DDC0005A-MFG]  (hidden comment: REF2033QDDCRQ1)
U12  Manufacturer: RECOM  [FP-R1SE-0505-R-MFG]  (hidden comment: R1SE-3.305/H2-R)
U19  R-78E5.0-1.0  Manufacturer Print: RECOM  [CONV_R-78E5.0-1.0]
U30  R-78E3.3-1.0  Manufacturer Print: RECOM  [CONV_R-78E3.3-1.0]
U31  R-78E5.0-1.0  Manufacturer Print: RECOM  [CONV_R-78E5.0-1.0]
U35  LT3581EMSE#PBF  Manufacturer Print: ANALOG DEVICES  [LT-MSE-16-EDP_L]
U36  LTC4368IMS-2#PBF  Manufacturer Print: ANALOG DEVICES  [SOP50P490X110-10N]
U37  LT3581EMSE#PBF  Manufacturer Print: ANALOG DEVICES  [LT-MSE-16-EDP_L]
U38  Manufacturer: TEXAS INSTRUMENTS  [FP-DDC0005A-MFG]  (hidden comment: REF2033QDDCRQ1)
U48  Manufacturer: TEXAS INSTRUMENTS  [FP-DDC0005A-MFG]  (hidden comment: REF2033QDDCRQ1)

### Blocks framed on the sheet
INPUT AUX POWER: J20
EXTERNAL FAN POWER: J9 J10
+3.3V AND +5V RAILS: C112 C125 C148 C149 C154 C155 U19 U30 U31
+15V RAIL: C37 C40 C44 C158-C160 D4 D5 L8 Q1 R98-R100 R106 R108 R109 R206 U35
STATUS LEDS: D6-D9 R207 R210 R213 R216
INPUT POWER CONDITIONING: C51 C52 C184 Q6 Q7 R111 R114-R118 R229 U36
VOLTAGE REFERENCE RAILS: C5 C61 C62 U38
-15V RAIL: C48-C50 C53 C182 C183 D19 L7 R112 R113 R119-R121 R230 U37
NTC ISOLATED +5V RAIL: C10 C63 U6
CURRENT REFERENCE RAILS: C11 C12 C15 U7
CAN ISOLATED +5V RAIL: C23 C67 U12
RESOLVER REFERENCE RAILS: C177 C179 C181 U48
TEST POINTS: TP5-TP9 TP13-TP15

### Nets
+1.65V_I: C15.1 U7.1(VBIAS)
+1.65V_R: C181.1 U48.1(VBIAS)
+1.65V_V: C5.1 U38.1(VBIAS)
+3.3V: C23.1 C149.1 R207.1 TP5.1 U12.2(+VIN) U30.3(+VOUT)
+3.3V_I: C12.1 U7.5(VREF)
+3.3V_R: C179.1 U48.5(VREF)
+3.3V_V: C61.1 U38.5(VREF)
+5V: C11.1 C62.1 C63.1 C148.1 C177.1 R210.2 TP6.1 U6.2(+VIN_(VCC)) U7.3(EN) U7.4(VIN) U31.3(+VOUT) U38.3(EN) U38.4(VIN) U48.3(EN) U48.4(VIN)
+5V_ALT: C112.1 U19.3(+VOUT)
+5V_ISO: C67.1 U12.5(+VOUT)
+5V_NTC: C10.1 U6.5(+VOUT)
+12V: C37.1 C48.1 C125.1 C154.1 C155.1 C184.1 D5.2(A) J9.1 J10.1 L7.1 L8.1 R99.2 R108.2 R112.2 R119.2 R229.2 TP14.1 U19.1(+VIN) U30.1(+VIN) U31.1(+VIN) U35.5(VIN) U36.8(VOUT) U37.5(VIN)
+15V: C40.1 Q1.5-6-7-8(D) R213.2 TP8.1
-15V: C183.1 D9.1(C) L7.2 R230.2 TP9.1
GND: C5.2 C11.2 C12.2 C15.2 C23.2 C37.2 C40.2 C44.2 C48.2 C49.2 C50.2 C51.2 C52.2 C53.2 C61.2 C62.2 C63.2 C112.2 C125.2 C148.2 C149.2 C154.2 C155.2 C158.2 C159.2 C160.2 C177.2 C179.2 C181.2 C183.2 C184.2 D6.1(C) D7.1(C) D8.1(C) D19.1(K) J9.2 J10.2 J20.2 J20.3 R106.1 R109.1 R111.1 R120.1 R121.1 R216.1 TP7.1 TP13.1 TP15.1 U6.1(-VIN_(GND)) U7.2(GND) U12.1(-VIN) U19.2(GND) U30.2(GND) U31.2(GND) U35.16(SYNC) U35.17(GND) U36.5(GND) U37.16(SYNC) U37.17(GND) U38.2(GND) U48.2(GND)
GND_ISO: C67.2 U12.4(-VOUT)
GND_NTC: C10.2 U6.4(-VOUT)
VIN: J20.1 Q6.5(D) R117.2 R118.2 U36.1(VIN)
VIN_MID: Q6.1,2,3(S) Q7.1,2,3(S)
VIN_PROTECT: Q7.5(D) R229.1 U36.9(SENSE)
NetC44_1: C44.1 U35.15(SS)
NetC49_1: C49.1 R113.2 U37.2(VC)
NetC50_1: C50.1 R113.1
NetC51_1: C51.1 R115.1
NetC52_1: C52.1 U36.4(RETRY)
NetC53_1: C53.1 U37.15(SS)
NetC158_1: C158.1 R206.1
NetC159_1: C159.1 D4.1(K) Q1.1,2,3(S) R98.2 R100.2
NetC160_1: C160.1 R206.2 U35.2(VC)
NetC182_1: C182.1 D19.2(A) L7.4
NetC182_2: C182.2 L7.3 U37.6,7,8(SW1) U37.9,10,11(SW2)
NetD4_2: D4.2(A) L8.2 U35.6,7,8(SW1) U35.9,10,11(SW2)
NetD5_1: D5.1(K) Q1.4(G) R98.1 U35.3(GATE)
NetD6_2: D6.2(A) R207.2
NetD7_2: D7.2(A) R210.1
NetD8_2: D8.2(A) R213.1
NetD9_2: D9.2(A) R216.2
NetQ6_4: Q6.4(G) Q7.4(G) R115.2 U36.10(GATE)
NetR99_1: R99.1 U35.4(~{FAULT})
NetR100_1: R100.1 U35.1(FB)
NetR106_2: R106.2 R108.1 U35.13(~{SHDN})
NetR109_2: R109.2 U35.14(RT)
NetR111_2: R111.2 R114.1 U36.3(OV)
NetR112_1: R112.1 U37.4(~{FAULT})
NetR114_2: R114.2 R116.1 U36.2(UV)
NetR116_2: R116.2 R118.1 U36.6(~{SHDN})
NetR117_1: R117.1 U36.7(~{FAULT})
NetR119_1: R119.1 R120.2 U37.13(~{SHDN})
NetR121_2: R121.2 U37.14(RT)
NetR230_1: R230.1 U37.1(FB)

Not connected (* = marked no-connect by the designer): U6 8(NC); U12 8(NC); U35 12(CLKOUT); U37 3(GATE) 12(CLKOUT)

### Notes on the sheet
- MATING: CUI DEVICES PP3-002A
- Title:
- Date:
- Drawing No:
- Size:
- Revision:
- Sheet:
- of